# Altium schematic sheet Э3А1.SchDoc: Усилитель
size 840 x 594 mm; CheckedBy: Семенцов С.Г.; Author: Дорунц Ш.А.; Address1: Address1; Address2: Address2; Address3: Address3; Address4: Address4; DocumentNumber: ИУ4.11.03.03.23.05.52.09.001 Э3; SheetNumber: 1; SheetTotal: 3; Scale: 1:1; Title2str: Низких Частот; DocumentType: Схема электрическая принципиальная; FirstReferrence: ИУ4.11.03.03.23.05.52.09.001; UniversityName: МГТУ им. Н.Э. Баумана; DepartmentName: Кафедра ИУ4; GroupName: Группа ИУ4-52Б
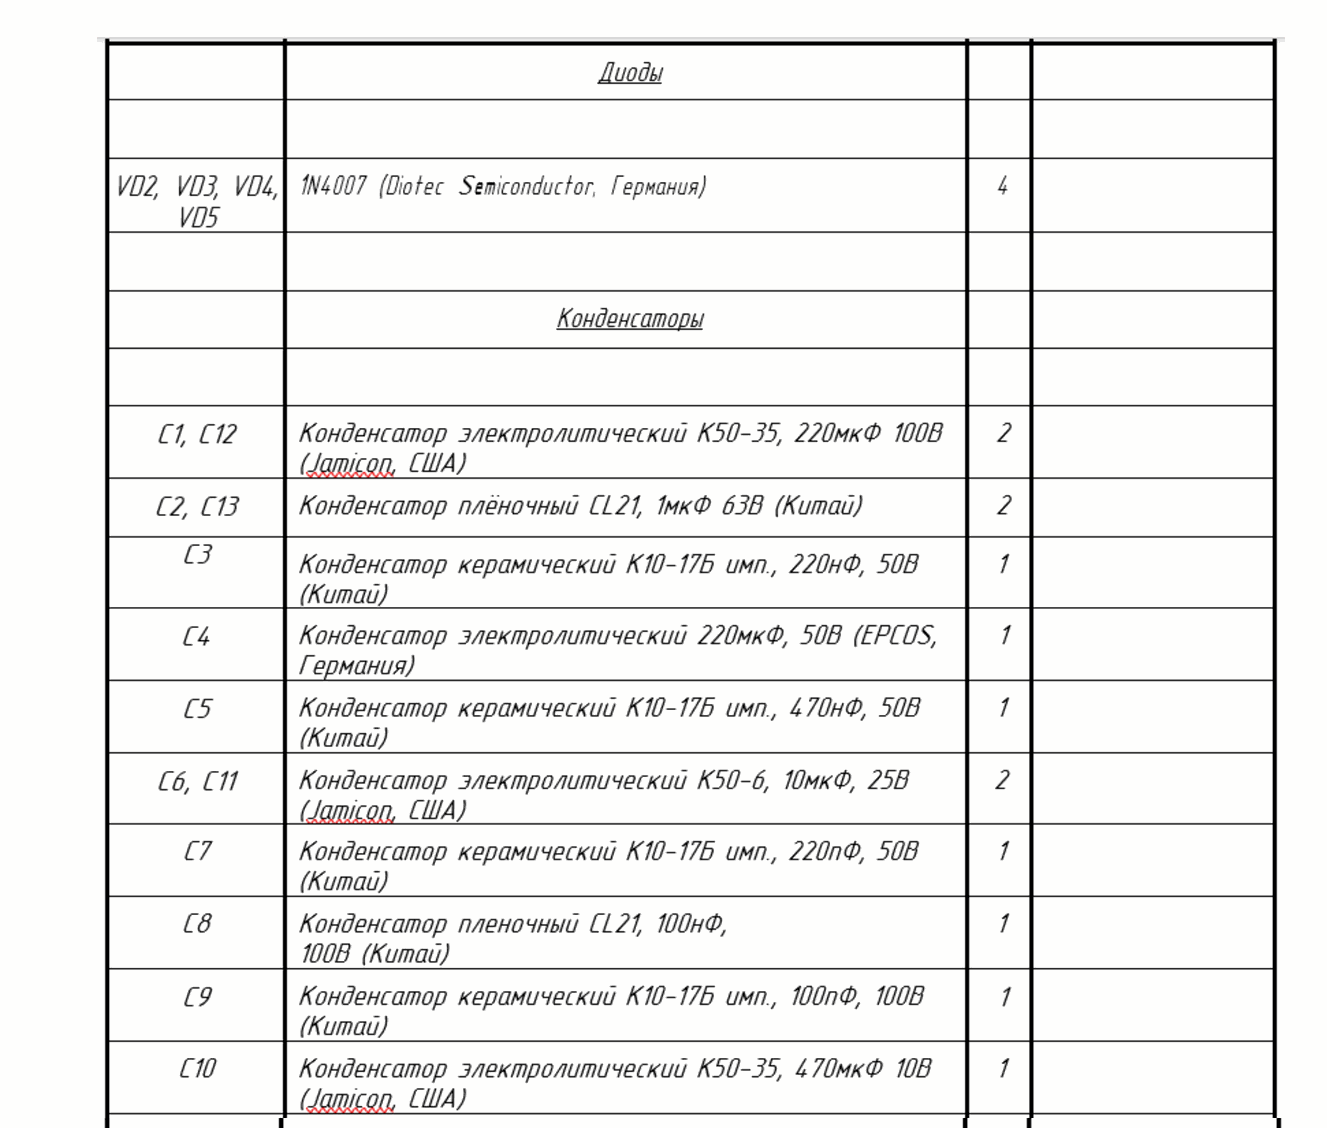
[diagram p0: Э3А1.SchDoc, top right]
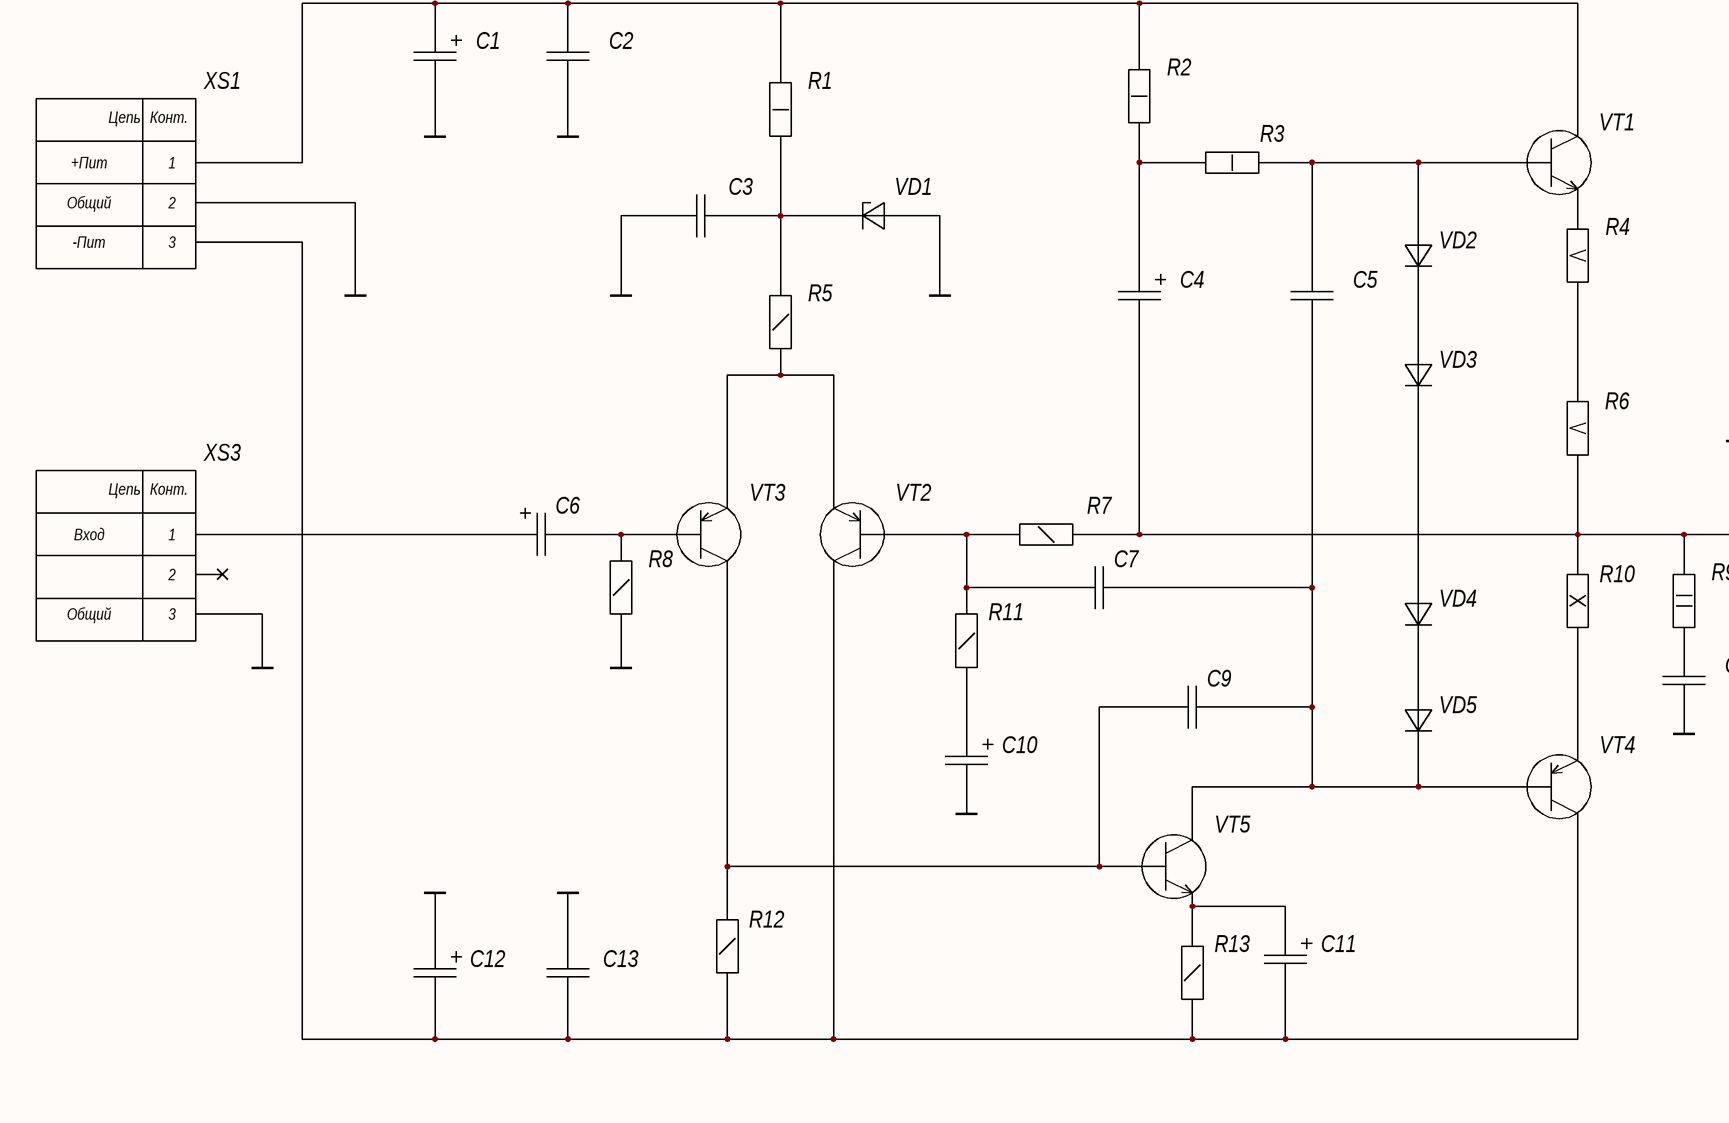
[diagram p1: Э3А1.SchDoc, bottom left]
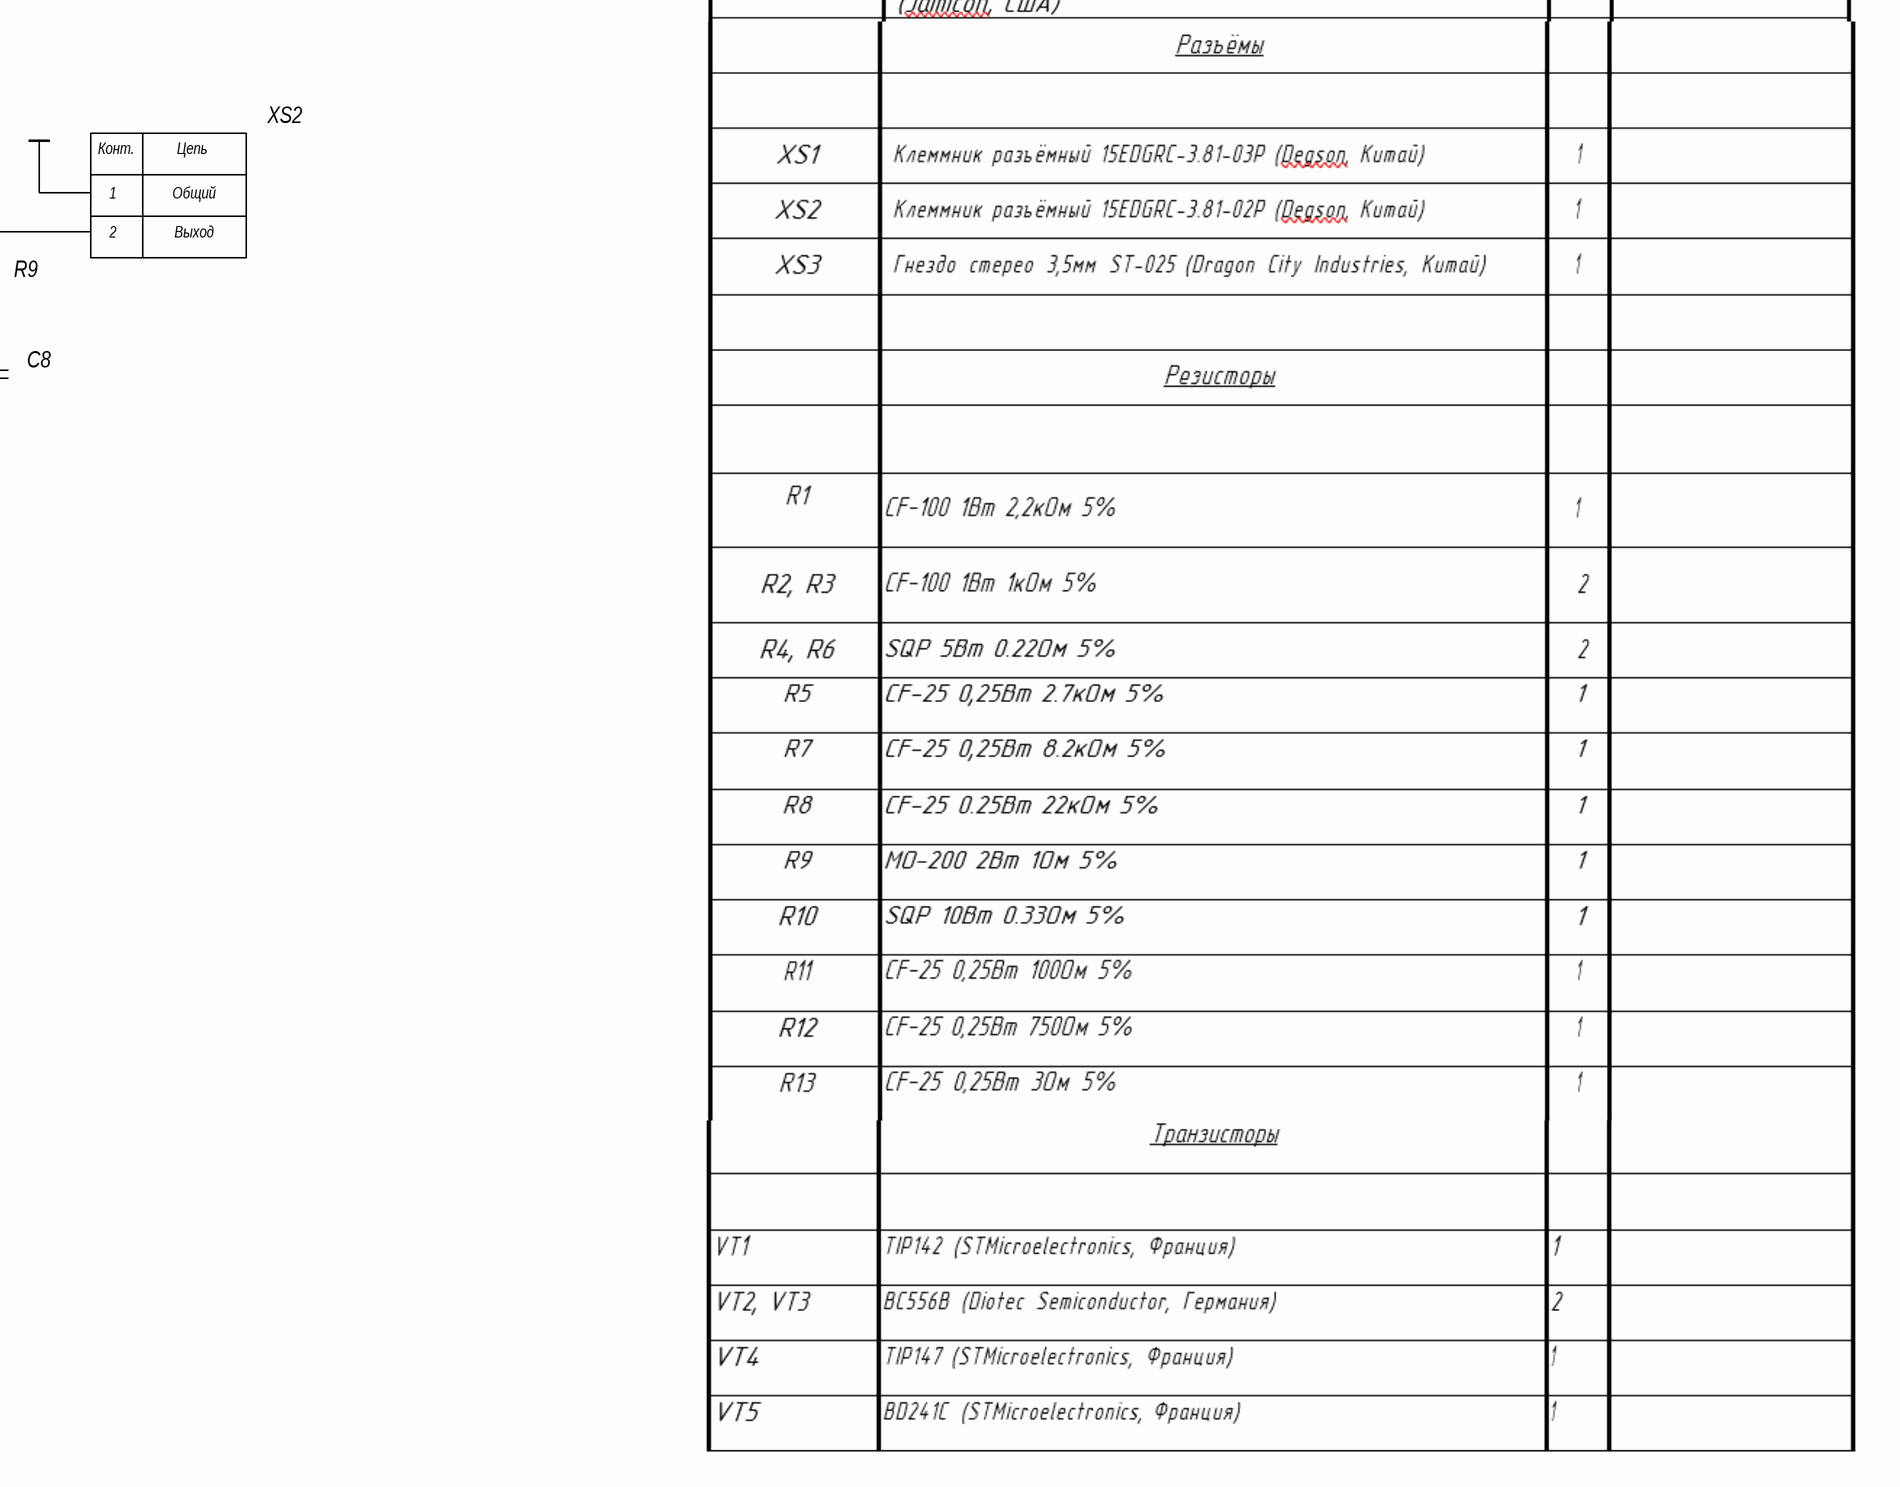
[diagram p2: Э3А1.SchDoc, bottom right]

## Parts
C1  220uF/100V  [Cap 220U/100V]  (value not drawn)
C2  1uF/63V  [Cap 1u/63V]  (value not drawn)
C3  220nF  [Cap 220nF]  (value not drawn)
C4  220uF/50V  [Cap 220U/100V]  (value not drawn)
C5  470nF  [Cap 470n]  (value not drawn)
C6  10uF/25V  [Cap 10u/25V]  (value not drawn)
C7  220pF  [Cap 220p]  (value not drawn)
C8  100nF/100V  [Cap 100n/100V]  (value not drawn)
C9  100pF/100V  [Cap 100p]  (value not drawn)
C10  470uF/10V  [Cap 470u/10V]  (value not drawn)
C11  10uF/25V  [Cap 10u/25V]  (value not drawn)
C12  220uF/100V  [Cap 220U/100V]  (value not drawn)
C13  1uF/63V  [Cap 1u/63V]  (value not drawn)
R1  Resistor 1W  [Res 1W]  (value not drawn)
R2  Resistor 1W  [Res 1W]  (value not drawn)
R3  Resistor 1W  [Res 1W]  (value not drawn)
R4  Resistor 5W  [Res 5W]  (value not drawn)
R5  Resistor 0.25W  [Res 0.25W]  (value not drawn)
R6  Resistor 5W  [Res 5W]  (value not drawn)
R7  Resistor 0.25W  [Res 0.25W]  (value not drawn)
R8  Resistor 0.25W  [Res 0.25W]  (value not drawn)
R9  Resistor 2W  [Res 2W]  (value not drawn)
R10  Resistor 10W  [Res 10W]  (value not drawn)
R11  Resistor 0.25W  [Res 0.25W]  (value not drawn)
R12  Resistor 0.25W  [Res 0.25W]  (value not drawn)
R13  Resistor 0.25W  [Res 0.25W]  (value not drawn)
VD1  ZPD12  [DO-35]  (value not drawn)
VD2  Diode 1N4001  [DO-41]  (value not drawn)
VD3  Diode 1N4001  [DO-41]  (value not drawn)
VD4  Diode 1N4001  [DO-41]  (value not drawn)
VD5  Diode 1N4001  [DO-41]  (value not drawn)
VT1  TIP142  [TO-247]  (value not drawn)
VT2  BC556B  [TO-92-A]  (value not drawn)
VT3  BC556B  [TO-92-A]  (value not drawn)
VT4  TIP147  [TO-247]  (value not drawn)
VT5  BD241C  [TO-220]  (value not drawn)
XS1  Connector 15EDGRC-3.81-03P  [15EDGRC-3.81-03P]  (value not drawn)
XS2  Connector 15EDGRC-3.81-02P  [15EDGRC-3.81-02P]  (value not drawn)
XS3  Connector ST-025  [ST-025]  (value not drawn)

## Nets
GND: C1.2 C2.1 C3.2 C8.1 C10.2 C12.1 C13.1 R8.1 VD1.1(А) XS1.2 XS2.1 XS3.3
NetC1_1: C1.1 C2.2 R1.2 R2.2 VT1.2(C) XS1.1
NetC3_1: C3.1 R1.1 R5.2 VD1.2(К)
NetC4_1: C4.1 R2.1 R3.1
NetC4_2: C4.2 R6.2 R7.2 R9.2 R10.2 XS2.2
NetC5_1: C5.1 C7.2 C9.2 VD5.2(К) VT4.1(B) VT5.2(C)
NetC5_2: C5.2 R3.2 VD2.1(А) VT1.1(B)
NetC6_1: C6.1 XS3.1
NetC6_2: C6.2 R8.2 VT3.2(B)
NetC7_1: C7.1 R7.1 R11.2 VT2.2(B)
NetC8_2: C8.2 R9.1
NetC9_1: C9.1 R12.2 VT3.1(C) VT5.1(B)
NetC10_1: C10.1 R11.1
NetC11_1: C11.1 R13.2 VT5.3(E)
NetC11_2: C11.2 C12.2 C13.2 R12.1 R13.1 VT2.1(C) VT4.2(C) XS1.3
NetR4_1: R4.1 VT1.3(E)
NetR4_2: R4.2 R6.1
NetR5_1: R5.1 VT2.3(E) VT3.3(E)
NetR10_1: R10.1 VT4.3(E)
NetVD2_2: VD2.2(К) VD3.1(А)
NetVD3_2: VD3.2(К) VD4.1(А)
NetVD4_2: VD4.2(К) VD5.1(А)

Not connected (* = marked no-connect by the designer): XS3 2*

## Notes on the sheet
- +Пит
- Общий
- -Пит
- Вход
- Выход
- Перв. примен.
- Справ. №
- Подп. и дата
- Инв. № дубл.
- Взам. инв. №
- Разраб.
- Изм.
- Лист
- № докум.
- Подп.
- Дата
- Лит.
- Масса
- Масштаб
- Пров.
- Т.контр.
- Листов
- 1
- Инв. № подл.
- Утв.
- Н.контр.
- 2.106-A1
- Копировал
- Формат А1
- (in symbol Connector 15EDGRC-3.81-02P) Конт.; Цепь
- (in symbol Connector 15EDGRC-3.81-03P) Цепь; Конт.
- (in symbol Connector ST-025) Цепь; Конт.

## Library data of the parts
C1 C12 = Capacitor 220uF 100V: Type: Конденсатор; Published: 18.05.2010; Publisher: Andrew Danich
C2 C13 = Capacitor 1uF 63V: Type: Конденсатор; Published: 18.05.2010; Publisher: Andrew Danich
C3 = Capacitor 220nF: Type: Конденсатор; Published: 18.05.2010; Publisher: Andrew Danich
C4 = Capacitor 220uF 50V: Type: Конденсатор; Published: 18.05.2010; Publisher: Andrew Danich
C5 = Capacitor 470nF: Type: Конденсатор; Published: 18.05.2010; Publisher: Andrew Danich
C6 C11 = Capacitor 10uF 25V: Type: Конденсатор; Published: 18.05.2010; Publisher: Andrew Danich
C7 = Capacitor 220pF: Type: Конденсатор; Published: 18.05.2010; Publisher: Andrew Danich
C8 = Capacitor 100nF 100V: Type: Конденсатор; Published: 18.05.2010; Publisher: Andrew Danich
C9 = Capacitor 100pF 100V: Type: Конденсатор; Published: 18.05.2010; Publisher: Andrew Danich
C10 = Capacitor 470uF 10V: Type: Конденсатор; Published: 18.05.2010; Publisher: Andrew Danich
VD1 = ZPD12: Type: Стабилитрон; Published: 20.05.2013; Publisher: Andrew Danich
VD2-VD5 = Diode 1N4001: Type: Диод; Published: 18.05.2010; Publisher: Andrew Danich
R1-R3 = Resistor 1W: Published: 24.03.2010; Publisher: Andrew Danich; Type: Резистор
R4 R6 = Resistor 5W: Published: 24.03.2010; Publisher: Andrew Danich; Type: Резистор
R5 R7 R8 R11-R13 = Resistor 0.25W: Published: 24.03.2010; Publisher: Andrew Danich; Type: Резистор
R9 = Resistor 2W: Published: 24.03.2010; Publisher: Andrew Danich; Type: Резистор
R10 = Resistor 10W: Published: 24.03.2010; Publisher: Andrew Danich; Type: Резистор